# Altium project Carte_Proto.PrjPcb
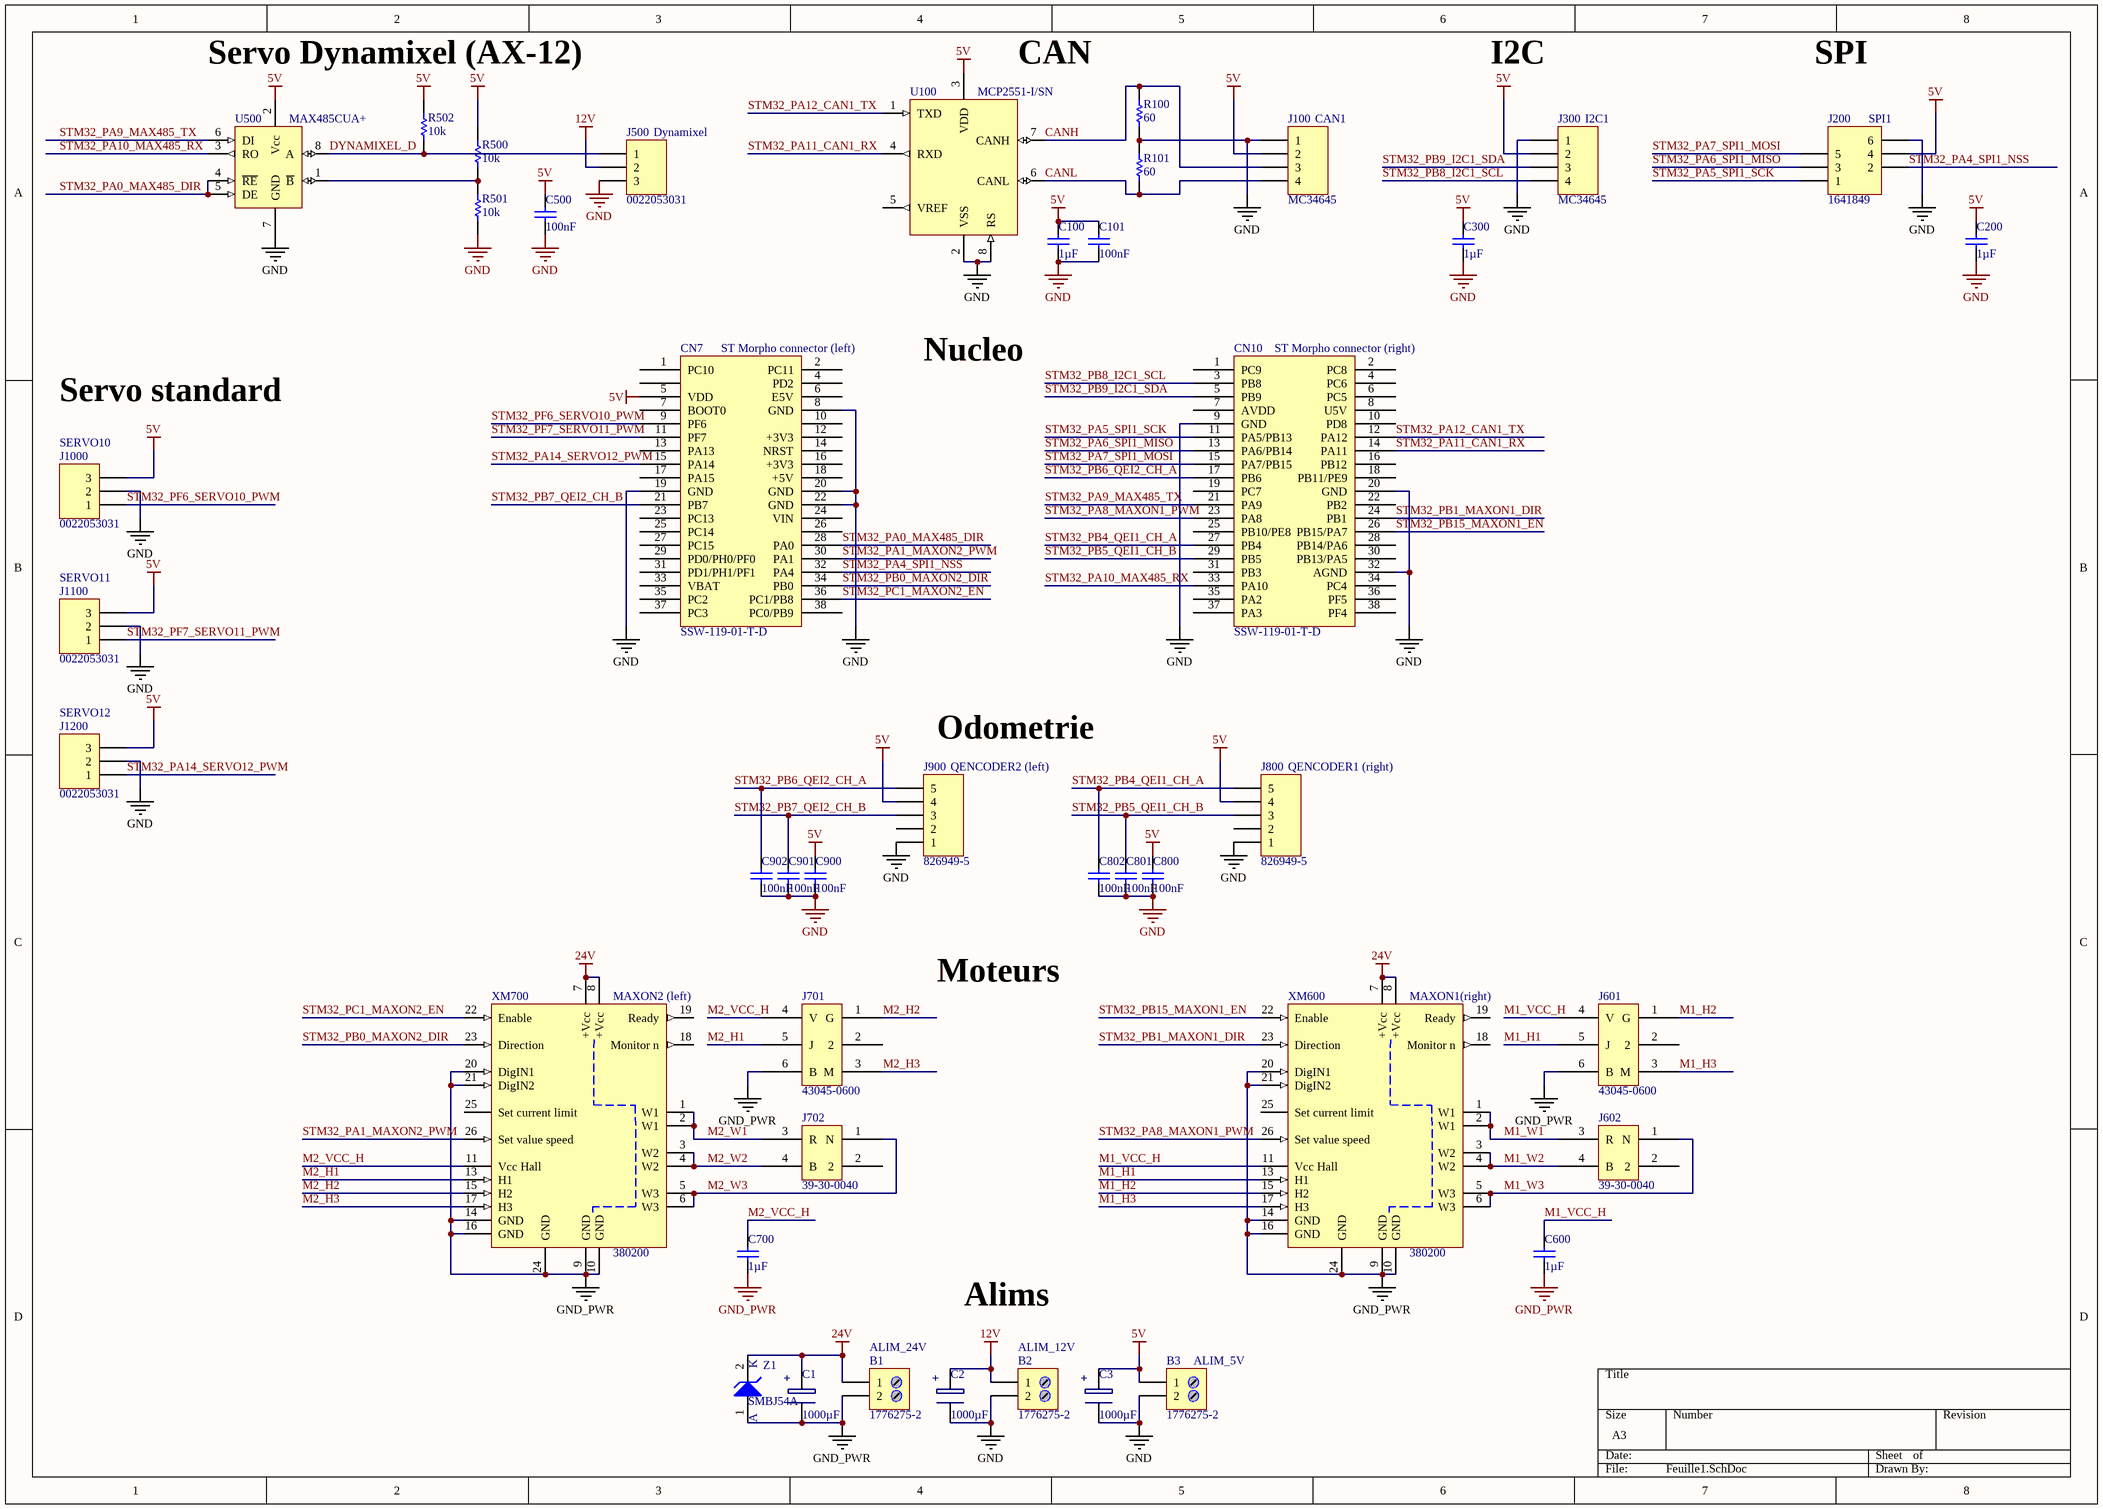
[diagram p0: Feuille1.SchDoc]
1 sheet, 44 parts. Net scope: global (net labels, ports and power ports of the same name join across sheets).
Board files: PCB1.PcbDoc, PCB1_OPTO.PcbDoc

## Sheet Feuille1.SchDoc
size A3

### Parts
B1  1776275-2  [BORNIER_2V_3.5MM]
B2  1776275-2  [BORNIER_2V_3.5MM]
B3  1776275-2  [BORNIER_2V_3.5MM]
C1  1000µF  [C_10mm]
C2  1000µF  [C_10mm]
C3  1000µF  [C_10mm]
C100  1µF  [C0805_N]
C101  100nF  [C0805_N]
C200  1µF  [C0805_N]
C300  1µF  [C0805_N]
C500  100nF  [C0805_N]
C600  1µF  [C0805_N]
C700  1µF  [C0805_N]
C800  100nF  [C0805_N]
C801  100nF  [C0805_N]
C802  100nF  [C0805_N]
C900  100nF  [C0805_N]
C901  100nF  [C0805_N]
C902  100nF  [C0805_N]
CN7  SSW-119-01-T-D  [CONN RCPT .100" 38POS DUAL TIN]
CN10  SSW-119-01-T-D  [CONN RCPT .100" 38POS DUAL TIN]
J100  MC34645  [HDR1X4]
J200  Supplier Part Number 1: 1641849  [690367280676]
J300  MC34645  [HDR1X4]
J500  0022053031  [HDR1X3]
J601  43045-0600  [43045-0600]
J602  39-30-0040  [39-30-0040]
J701  43045-0600  [43045-0600]
J702  39-30-0040  [39-30-0040]
J800  826949-5  [HDR1X5]
J900  826949-5  [HDR1X5]
J1000  0022053031  [HDR1X3]
J1100  0022053031  [HDR1X3]
J1200  0022053031  [HDR1X3]
R100  60  [R0805_N]
R101  60  [R0805_N]
R500  10k  [R0805_N]
R501  10k  [R0805_N]
R502  10k  [R0805_N]
U100  MCP2551-I/SN  [SO8_N]
U500  MAX485CUA+  [MMAX-8]
XM600  380200  [380200_goldo]
XM700  380200  [380200_goldo]
Z1  SMBJ54A  [SMA Diode (DO-214AA)]

### Nets
5V: B3.1 C3.2 C100.2 C101.2 C200.2 C300.2 C500.2 C800.2 C900.2 CN7.5(VDD) J100.2 J200.4 J300.2 J800.4 J900.4 J1000.3 J1100.3 J1200.3 R500.2 R502.2 U100.3(VDD) U500.2(Vcc)
12V: B2.1 C2.2 J500.2
24V: B1.1 C1.2 XM600.7(+Vcc) XM600.8(+Vcc) XM700.7(+Vcc) XM700.8(+Vcc) Z1.2
GND: B2.2 B3.2 C2.1 C3.1 C100.1 C101.1 C200.1 C300.1 C500.1 C800.1 C801.1 C802.1 C900.1 C901.1 C902.1 CN7.8(GND) CN7.19(GND) CN7.20(GND) CN7.22(GND) CN10.9(GND) CN10.20(GND) CN10.32(AGND) J100.1 J200.6 J300.1 J500.3 J800.1 J900.1 J1000.2 J1100.2 J1200.2 R100.1 R101.2 R501.1 U100.2(VSS) U100.8(RS) U500.7(GND)
GND_PWR: B1.2 C1.1 C600.1 C700.1 J601.6(B) J701.6(B) XM600.9(GND) XM600.10(GND) XM600.14(GND) XM600.16(GND) XM600.20(DigIN1) XM600.21(DigIN2) XM600.24(GND) XM700.9(GND) XM700.10(GND) XM700.14(GND) XM700.16(GND) XM700.20(DigIN1) XM700.21(DigIN2) XM700.24(GND) Z1.1
CANH: J100.3 R100.2 U100.7(CANH)
CANL: J100.4 R101.1 U100.6(CANL)
DYNAMIXEL_D: J500.1 R502.1 U500.8(A)
M1_H1: J601.5(J) XM600.13(H1)
M1_H2: J601.1(G) XM600.15(H2)
M1_H3: J601.3(M) XM600.17(H3)
M1_VCC_H: C600.2 J601.4(V) XM600.11(Vcc_Hall)
M1_W1: J602.3(R) XM600.1(W1) XM600.2(W1)
M1_W2: J602.4(B) XM600.3(W2) XM600.4(W2)
M1_W3: J602.1(N) XM600.5(W3) XM600.6(W3)
M2_H1: J701.5(J) XM700.13(H1)
M2_H2: J701.1(G) XM700.15(H2)
M2_H3: J701.3(M) XM700.17(H3)
M2_VCC_H: C700.2 J701.4(V) XM700.11(Vcc_Hall)
M2_W1: J702.3(R) XM700.1(W1) XM700.2(W1)
M2_W2: J702.4(B) XM700.3(W2) XM700.4(W2)
M2_W3: J702.1(N) XM700.5(W3) XM700.6(W3)
STM32_PA0_MAX485_DIR: CN7.28(PA0) U500.4(~{RE}) U500.5(DE)
STM32_PA1_MAXON2_PWM: CN7.30(PA1) XM700.26(Set_value_speed)
STM32_PA4_SPI1_NSS: CN7.32(PA4) J200.2
STM32_PA5_SPI1_SCK: CN10.11(PA5/PB13) J200.1
STM32_PA6_SPI1_MISO: CN10.13(PA6/PB14) J200.3
STM32_PA7_SPI1_MOSI: CN10.15(PA7/PB15) J200.5
STM32_PA8_MAXON1_PWM: CN10.23(PA8) XM600.26(Set_value_speed)
STM32_PA9_MAX485_TX: CN10.21(PA9) U500.6(DI)
STM32_PA10_MAX485_RX: CN10.33(PA10) U500.3(RO)
STM32_PA11_CAN1_RX: CN10.14(PA11) U100.4(RXD)
STM32_PA12_CAN1_TX: CN10.12(PA12) U100.1(TXD)
STM32_PA14_SERVO12_PWM: CN7.15(PA14) J1200.1
STM32_PB0_MAXON2_DIR: CN7.34(PB0) XM700.23(Direction)
STM32_PB1_MAXON1_DIR: CN10.24(PB1) XM600.23(Direction)
STM32_PB4_QEI1_CH_A: C802.2 CN10.27(PB4) J800.5
STM32_PB5_QEI1_CH_B: C801.2 CN10.29(PB5) J800.3
STM32_PB6_QEI2_CH_A: C902.2 CN10.17(PB6) J900.5
STM32_PB7_QEI2_CH_B: C901.2 CN7.21(PB7) J900.3
STM32_PB8_I2C1_SCL: CN10.3(PB8) J300.4
STM32_PB9_I2C1_SDA: CN10.5(PB9) J300.3
STM32_PB15_MAXON1_EN: CN10.26(PB15/PA7) XM600.22(Enable)
STM32_PC1_MAXON2_EN: CN7.36(PC1/PB8) XM700.22(Enable)
STM32_PF6_SERVO10_PWM: CN7.9(PF6) J1000.1
STM32_PF7_SERVO11_PWM: CN7.11(PF7) J1100.1
NetR500_1: R500.1 R501.2 U500.1(~{B})

Not connected (* = marked no-connect by the designer): CN7 1(PC10) 2(PC11) 3(PC12) 4(PD2) 6(E5V) 7(BOOT0) 10 12(+3V3) 13(PA13) 14(NRST) 16(+3V3) 17(PA15) 18(+5V) 23(PC13) 24(VIN) 25(PC14) 26 27(PC15) 29(PD0/PH0/PF0) 31(PD1/PH1/PF1) 33(VBAT) 35(PC2) 37(PC3) 38(PC0/PB9); CN10 1(PC9) 2(PC8) 4(PC6) 6(PC5) 7(AVDD) 8(U5V) 10(PD8) 16(PB12) 18(PB11/PE9) 19(PC7) 22(PB2) 25(PB10/PE8) 28(PB14/PA6) 30(PB13/PA5) 31(PB3) 34(PC4) 35(PA2) 36(PF5) 37(PA3) 38(PF4); J601 2; J602 2; J701 2; J702 2; J800 2; J900 2; U100 5(VREF); XM600 12(nc) 18(Monitor_n) 19(Ready) 25(Set_current_limit); XM700 12(nc) 18(Monitor_n) 19(Ready) 25(Set_current_limit)

### Notes on the sheet
- Servo Dynamixel (AX-12)
- (near U100) CAN
- I2C
- SPI
- (near J500) Dynamixel
- (near J100) CAN1
- (near J300) I2C1
- (near J200) SPI1
- (near CN7) ST Morpho connector (left)
- Nucleo
- (near CN10) ST Morpho connector (right)
- (near J1000) SERVO10
- Servo standard
- (near J1100) SERVO11
- (near J1200) SERVO12
- (near J900) Odometrie
- (near J900) QENCODER2 (left)
- (near J800) QENCODER1 (right)
- Moteurs
- (near XM700) MAXON2 (left)
- (near XM600) MAXON1(right)
- Alims
- ALIM_24V
- ALIM_12V
- (near B3) ALIM_5V
- (in symbol C_1000µF) +
- (in symbol SMBJ54A) K; A

### Library data of the parts
B1-B3 = 1776275-2: TERM BLOCK 2POS SIDE ENT 3.5MM; Manufacturer: TE Connectivity AMP Connectors; Supplier 1: Farnell; Supplier Part Number 1: 1098611; Manufacturer Part Number: 1776275-2; ComponentLink1URL: http://www.te.com/commerce/DocumentDelivery/DDEController?Action=srchrtrv&DocNm=1776275&DocType=Customer+Drawing&DocLang=English; ComponentLink1Description: http://www.te.com/commerce/DocumentDelivery/DDEController?Action=srchrtrv&DocNm=1776275&DocType=Customer+Drawing&DocLang=English
C1-C3 = C_1000µF: Manufacturer: PANASONIC; Manufacturer Part Number: EEUHD1E102; Supplier 1: Farnell; Supplier Part Number 1: 1973481; Pricing: 1=0.88, 50=0.64, 100=0.53, 500=0.42, 1000=0.39 (EUR); ComponentLink1URL: http://www.farnell.com/datasheets/1446031.pdf; ComponentLink1Description: http://www.farnell.com/datasheets/1446031.pdf; ComponentLink2URL: http://www.farnell.com/cad/1703926.zip; ComponentLink2Description: http://www.farnell.com/cad/1703926.zip
C100 C101 C200 C300 C500 C600 C700 C800-C802 C900-C902 = Condensateur: Capacitor; Published: 8-Jun-2000; LatestRevisionDate: 17-Jul-2002; LatestRevisionNote: Re-released for DXP Platform.; PackageReference: RAD-0.3; Publisher: Altium Limited
  C100 C200 C300 C600 C700: Value: 1µF
  C101 C500 C800-C802 C900-C902: Value: 100nF
CN7 CN10 = SSW-119-01-T-D: CONN RCPT .100" 38POS DUAL TIN; Manufacturer: Samtec Inc.; Supplier 1: Farnell; Supplier Part Number 1: 2667437; Manufacturer Part Number: SSW-119-01-T-D; ComponentLink1URL: http://suddendocs.samtec.com/prints/ssw-1xx-xx-xxx-x-xx-xxx-xx-mkt.pdf; ComponentLink1Description: http://suddendocs.samtec.com/prints/ssw-1xx-xx-xxx-x-xx-xxx-xx-mkt.pdf
J100 J300 = MC34645: MULTICOMP - MC34645 - EMB. MALE COUDEE  CON. MALE 2.54MM 4VOIE; Supplier 1: Farnell; Manufacturer: MULTICOMP; Manufacturer Part Number: MC34645; ComponentLink1URL: http://www.farnell.com/datasheets/1751312.pdf; ComponentLink1Description: http://www.farnell.com/datasheets/1751312.pdf; Pricing: 1=0.597, 5=0.531, 25=0.465, 50=0.399, 100=0.334, 250=0.138 (EUR); Supplier Part Number 1: 1675775
J200 = WE-WR-MM Female SMT Connector with Polarization 690367280676: WR-MM Female SMT Connector with Polarization; Manufacturer 1: W¨¹rth Elektronik eiSos GmbH; ComponentLink1 Description: Manufacturer; ComponentLink2 Description: Datasheet; Value: 6; ComponentLink1URL: http://www.we-online.com; ComponentLink2URL: http://katalog.we-online.de/em/datasheet/69036728xx76.pdf; Manufacturer Part Number: 690367280676; Supplier 1: Farnell
J500 J1000 J1100 J1200 = 0022053031: CONN HEADER 3POS .100 R/A TIN; Manufacturer: Molex, LLC; Supplier 1: Farnell; Supplier Part Number 1: 1462932; Manufacturer Part Number: 0022053031; ComponentLink1URL: http://www.molex.com/pdm_docs/sd/022053031_sd.pdf; ComponentLink1Description: http://www.molex.com/pdm_docs/sd/022053031_sd.pdf
J601 J701 = 43045-0600: CONN HEADER 6POS 3MM RT ANG TIN; Manufacturer: MOLEX; Supplier 1: Farnell; Manufacturer Part Number: 43045-0600; ComponentLink1URL: http://www.farnell.com/datasheets/2216475.pdf; ComponentLink1Description: http://www.farnell.com/datasheets/2216475.pdf; Supplier Part Number 1: 1012252
J602 J702 = 39-30-0040: MOLEX  39-30-0040 4.2 mm, 4 Contact(s); Supplier 1: Farnell; Supplier Part Number 1: 1697133; Manufacturer: MOLEX; Manufacturer Part Number: 39-30-0040; ComponentLink1URL: http://www.farnell.com/datasheets/328793.pdf; ComponentLink1Description: http://www.farnell.com/datasheets/328793.pdf
J800 J900 = 826949-5: CONN HEADER BRKWY 5POS R/A TIN; Manufacturer: TE Connectivity AMP Connectors; Supplier 1: Farnell; Manufacturer Part Number: 826949-5; ComponentLink1URL: http://www.te.com/commerce/DocumentDelivery/DDEController?Action=srchrtrv&DocNm=826629&DocType=Customer+Drawing&DocLang=English; ComponentLink1Description: http://www.te.com/commerce/DocumentDelivery/DDEController?Action=srchrtrv&DocNm=826629&DocType=Customer+Drawing&DocLang=English; Supplier Part Number 1: 1248179
R100 R101 R500-R502 = Resistor: Published: 8-Jun-2000; LatestRevisionDate: 17-Jul-2002; LatestRevisionNote: Re-released for DXP Platform.; PackageReference: AXIAL-0.5; Publisher: Altium Limited
  R100 R101: Value: 60
  R500-R502: Value: 10k
U100 = MCP2551-I/SN: IC TRANSCEIVER CAN HI-SPD 8-SOIC; Manufacturer: Microchip Technology; Manufacturer Part Number: MCP2551-I/SN; ComponentLink1Description: Datasheet; ComponentLink1URL: http://www.farnell.com/datasheets/657417.pdf; Supplier 1: Farnell; Supplier Part Number 1: 9758569
U500 = MAX485CUA+: IC TXRX RS485/RS422 8-UMAX; Manufacturer: Maxim Integrated; Manufacturer Part Number: MAX485CUA+; ComponentLink1URL: http://datasheets.maximintegrated.com/en/ds/MAX1487-MAX491.pdf; ComponentLink1Description: http://datasheets.maximintegrated.com/en/ds/MAX1487-MAX491.pdf; Supplier 1: Farnell; Supplier Part Number 1: 2511735
XM600 XM700 = 380200: DEC Module 50/5, amplificateur EC 1 Q 50 V / 5 A, régulation de vitesse, module OEM; Manufacturer: Maxon Motor; Manufacturer Part Number: 380200; ComponentLink1URL: http://www.maxonmotor.fr/medias/sys_master/root/8816547528734/380200-Notice-dUtilisation-Fr.pdf; ComponentLink1Description: http://www.maxonmotor.fr/medias/sys_master/root/8816547528734/380200-Notice-dUtilisation-Fr.pdf
Z1 = SMBJ54A: DIODE TVS (Transil unidirectionelle); Manufacturer: ON Semiconductor; Value: 54V; Supplier 1: Farnell; Manufacturer Part Number: SMBJ54A; ComponentLink1URL: http://www.fairchildsemi.com/datasheets/SM/SMBJ54A.pdf; ComponentLink1Description: http://www.fairchildsemi.com/datasheets/SM/SMBJ54A.pdf; Supplier part number 1: 1700734